# EAGLE design 555TimerBlink (EAGLE 8.7.0)
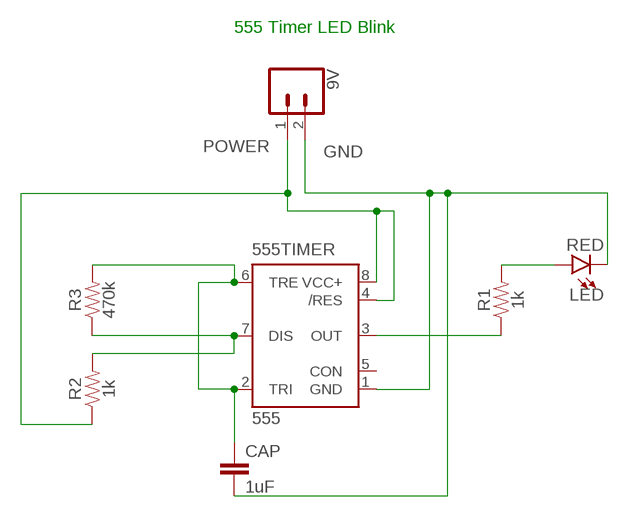
[diagram p0: schematic, sheet 1]

## Parts
9V  CONN_02  [1X02]
555TIMER  555  555KIT  [DIP08-KIT]
CAP  1uF  10NF-PTH-10MM-10000V-1-%  [CAP-PTH-10MM]
LED  RED  LED-3MM-NO_SILK  [LED_3MM-NS]
R1  1k  1KOHM-HORIZ-1/4W-5%  [AXIAL-0.3]
R2  1k  1KOHM-HORIZ-1/4W-5%  [AXIAL-0.3]
R3  470k  1KOHM-HORIZ-1/4W-5%  [AXIAL-0.3]

## Nets
GND: 9V.2 555TIMER.1(GND) CAP.2 LED.K(C)
N$2: 555TIMER.2(TRI) 555TIMER.6(TRE) CAP.1 R3.P$2
N$3: 555TIMER.7(DIS) R2.P$2 R3.P$1
N$5: 555TIMER.3(OUT) R1.P$1
N$6: LED.A R1.P$2
POWER: 9V.1 555TIMER.4(/RES) 555TIMER.8(VCC+) R2.P$1
Unconnected: 555TIMER.5(CON)

## Notes on the sheet
- 555 Timer LED Blink

## Library data of the parts
9V = SparkFun-Connectors:CONN_02: Multi connection point. Often used as Generic Header-pin footprint for 0.1 inch spaced/style header connections On any of the 0.1 inch spaced packages, you can populate with these: Break Away Headers - Straight <https://www.sparkfun.com/products/116> (PRT-00116) Break Away Male Headers - Right Angle <https://www.sparkfun.com/products/553> (PRT-00553) Female Headers <https://www.sparkfun.com/products/115> (PRT-00115) Break Away Headers - Machine Pin <https://www.sparkfun.com/products/117> (PRT-00117) Break Away Female Headers - Swiss Machine Pin <https://www.sparkfun.com/products/743> (PRT-00743) For SCREWTERMINALS and SPRING TERMINALS visit here: Screw Terimnals on SparkFun.com <https://www.sparkfun.com/search/results?term=Screw+Terminals> (5mm/3.5mm/2.54mm spacing) This device is also useful as a general connection point to wire up your design to another part of your project. Our various solder wires solder well into these plated through hole pads. Hook-Up Wire - Assortment (Stranded, 22 AWG) <https://www.sparkfun.com/products/11375> (PRT-11375) Hook-Up Wire - Assortment (Solid Core, 22 AWG) <https://www.sparkfun.com/products/11367> (PRT-11367) View the entire wire category on our website here <https://www.sparkfun.com/categories/141> Special notes: Molex polarized connector foot print use with: PRT-08233 with associated crimp pins and housings. 2.54_SCREWTERM for use with PRT-10571. 3.5mm Screw Terminal footprints for PRT-08084 5mm Screw Terminal footprints for use with PRT-08432
555TIMER = SparkFun-IC-Special-Function:555: General purpose bipolar Timer Datasheet <http://www.sparkfun.com/datasheets/Components/General/ne555.pdf> SparkFun Products SparkFun SparkPunk Sequencer Kit <https://www.sparkfun.com/products/12707> (KIT-12707) Storefront Component: 555 Timer <https://www.sparkfun.com/products/9273> (COM-09273) Two parts valid for production: VFP: IC-11930 (M7555 PTH) VFP: IC-09173 (555 PTH) - Preferred; PROD_ID: IC-09173; PROD_ID_ALT: IC-11930
CAP = SparkFun-Capacitors:10NF: 0.01uF/10nF/10,000pF ceramic capacitors A capacitor is a passive two-terminal electrical component used to store electrical energy temporarily in an electric field. CAP-09321; PROD_ID: CAP-09321; VALUE: 10nF
LED = SparkFun-LED:LED: LED (Generic) Standard schematic elements and footprints for 5mm, 3mm, 1206, and 0603 sized LEDs. Generic LEDs with no color specified.
R1 R2 = SparkFun-Resistors:1KOHM: 1kΩ resistor A resistor is a passive two-terminal electrical component that implements electrical resistance as a circuit element. Resistors act to reduce current flow, and, at the same time, act to lower voltage levels within circuits. - Wikipedia; PROD_ID: RES-08380
R3 = SparkFun-Resistors:1KOHM: 1kΩ resistor A resistor is a passive two-terminal electrical component that implements electrical resistance as a circuit element. Resistors act to reduce current flow, and, at the same time, act to lower voltage levels within circuits. - Wikipedia; PROD_ID: RES-08380; VALUE: 1k

## Board
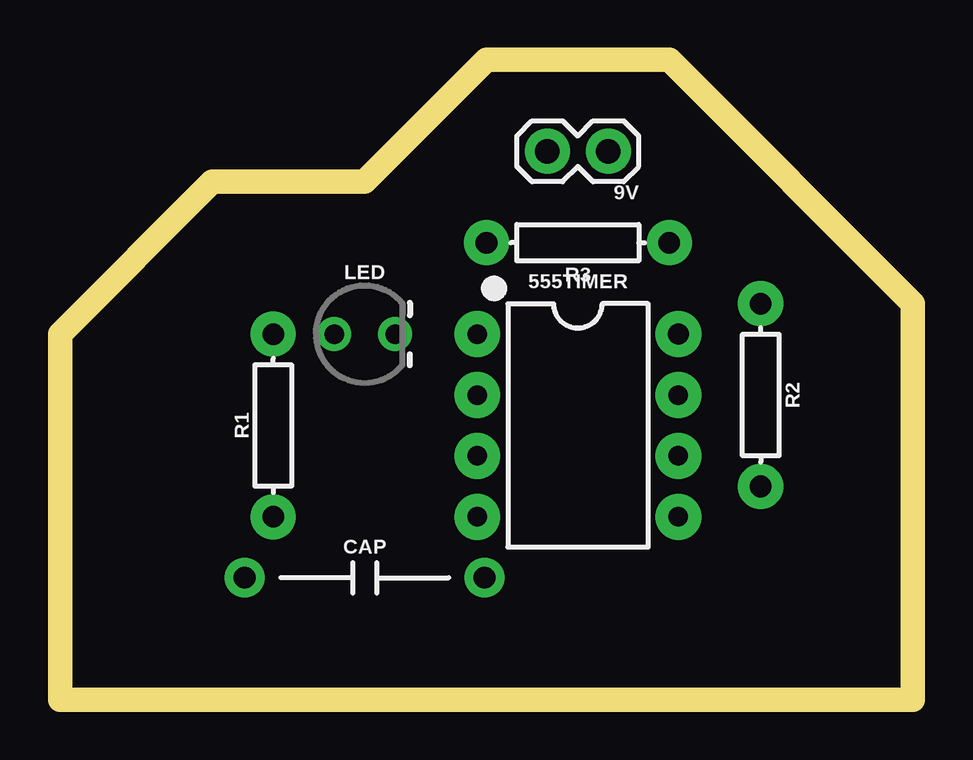
[diagram p1: board, top side]
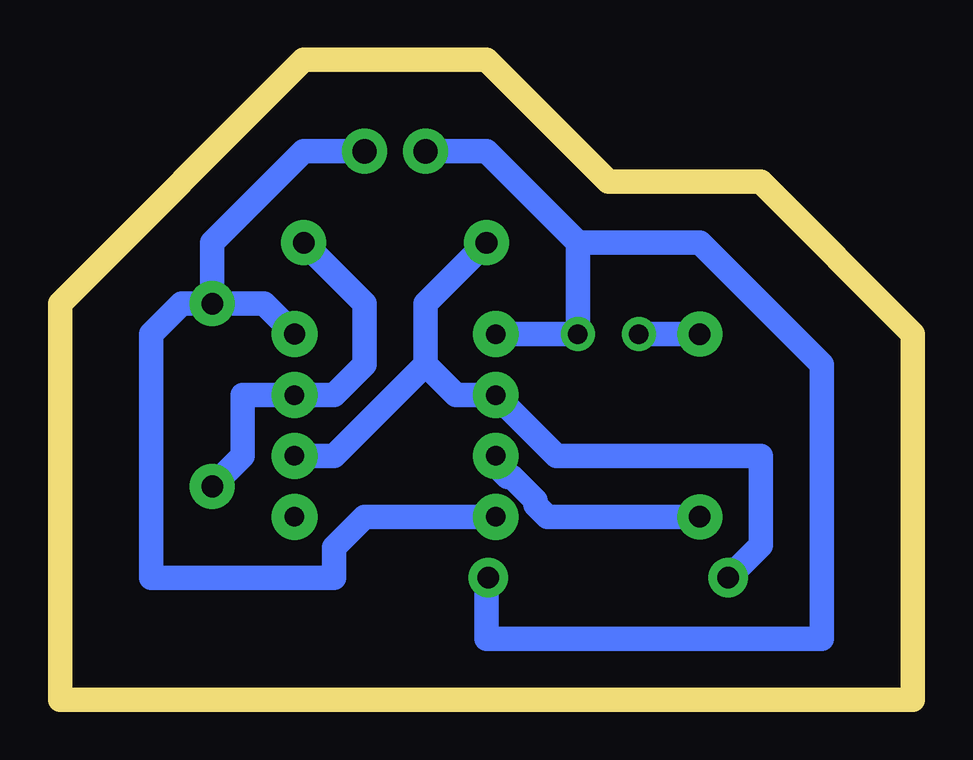
[diagram p2: board, bottom side, seen from below]

Size 35.56 x 26.67 mm. Coordinates in mm from the lower left corner, seen from the top.
Outline: 25.4,26.67 17.78,26.67 12.7,21.59 6.35,21.59 0,15.24 0,0 35.56,0 35.56,16.51 25.4,26.67
Copper layers (1*16): Top 0.035mm / dielectric 1.5mm / Bottom 0.035mm
Design rules "SparkFun *": minimum track width 8mil, minimum drill 20mil, track to track 8mil, track to pad 8mil, pad to pad 8mil, via to via 8mil, smd to smd 8mil, copper to edge 8mil, drill to drill 8mil, minimum pad ring 12mil, minimum via ring 10mil, stop-mask expansion 4mil, vias tented up to drill 20mil, thermal gap 10mil

### Footprints (pad centres in the part's own frame; a part is rotated, then mirrored left to right if it is on the bottom)
1X02 = drill 1.016 pad 1.88: 1 0,0; 2 2.54,0
DIP08-KIT = drill 0.813 pad 1.905: 1 -3.81,-4.191; 2 -1.27,-4.191; 3 1.27,-4.191; 4 3.81,-4.191; 5 3.81,4.191; 6 1.27,4.191; 7 -1.27,4.191 | drill 0.864 pad 1.905: 8 -3.81,4.191
CAP-PTH-10MM = drill 0.9 pad 1.651: 1 -5,0; 2 5,0
LED_3MM-NS = drill 0.813: A -1.27,0; K 1.27,0
AXIAL-0.3 = drill 0.9 pad 1.88: P$1 -3.81,0; P$2 3.81,0

### Placement (x,y rotation side)
9V  22.86,22.86 180 top
555TIMER  21.59,11.43 270 top
CAP  12.7,5.08 0 top
LED  12.7,15.24 0 top
R1  8.89,11.43 90 top
R2  29.21,12.7 270 top
R3  21.59,19.05 180 top

### Tracks (layer width: path | path; a pad name or v marks a point on that pad's centre or on a via)
GND
  Bottom 1.016: 555TIMER.1 LED.K 13.97,19.05 | CAP.2 17.78,5 17.78,2.54 3.81,2.54 3.81,13.97 8.89,19.05 13.97,19.05 | 13.97,19.05 17.78,22.86 9V.2
N$2
  Bottom 1.016: CAP.1 6.35,6.43 6.35,10.16 14.86,10.16 555TIMER.2 19.05,12.7 20.32,13.97 | R3.P$2 20.32,16.51 20.32,13.97 | 555TIMER.6 24.13,10.16 20.32,13.97
N$3
  Bottom 1.016: R3.P$1 22.86,16.51 22.86,13.97 24.13,12.7 555TIMER.7 27.94,12.7 27.94,10.16 R2.P$2
N$5
  Bottom 1.016: R1.P$1 15.24,7.62 15.74,8.11 15.74,8.31 16.71,9.28 16.9,9.28 17.4,9.78 555TIMER.3
N$6
  Bottom 1.016: R1.P$2 LED.A
POWER
  Bottom 1.016: 555TIMER.8 27.05,16.51 R2.P$1 | R2.P$1 29.21,19.05 25.4,22.86 9V.1 | 555TIMER.4 22.86,7.62 24.13,6.35 24.13,5.08 31.75,5.08 31.75,15.24 30.48,16.51 R2.P$1